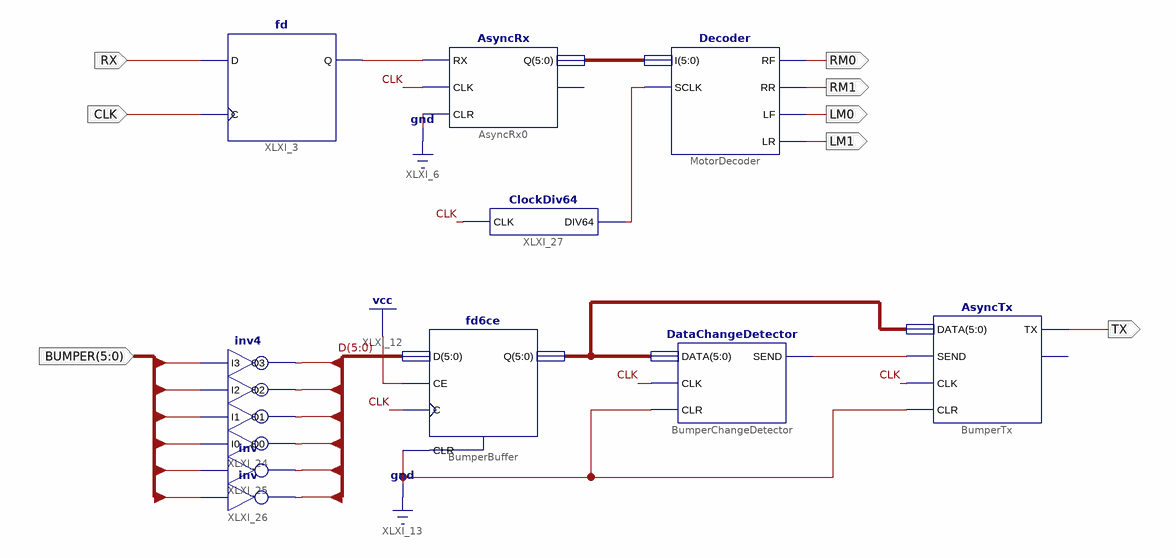
[diagram p0: schematic sheet 1]
// Xilinx ISE schematic RobotMain.sch (xc9500xl) as structural Verilog: 11 symbols, 8 ports
module RobotMain (
  input  RX,
  input  CLK,
  input  [5:0] BUMPER,
  output RM0,
  output RM1,
  output LM0,
  output LM1,
  output TX
);

  wire XLXN_1, XLXN_11, XLXN_27;
  wire [5:0] D, XLXN_7, XLXN_10;

  AsyncRx AsyncRx0 (.CLK(CLK), .CLR(1'b0), .Q(XLXN_7), .RX(XLXN_1));  // open: UPDATE
  fd XLXI_3 (.C(CLK), .D(RX), .Q(XLXN_1));
  Decoder MotorDecoder (.I(XLXN_7), .LF(LM0), .LR(LM1), .RF(RM0), .RR(RM1), .SCLK(XLXN_27));
  ClockDiv64 ClockDivider (.CLK(CLK));  // open: DIV64
  DataChangeDetector BumperChangeDetector (.CLK(CLK), .CLR(1'b0), .DATA(XLXN_10), .SEND(XLXN_11));
  fd6ce BumperBuffer (.C(CLK), .CE(1'b1), .CLR(1'b0), .D(D), .Q(XLXN_10));
  AsyncTx BumperTx (.CLK(CLK), .CLR(1'b0), .DATA(XLXN_10), .SEND(XLXN_11), .TX(TX));  // open: ACTIVE
  not XLXI_26 (D[5], BUMPER[5]);
  not XLXI_25 (D[4], BUMPER[4]);
  inv4 XLXI_24 (
    .I0(BUMPER[3]), .I1(BUMPER[2]), .I2(BUMPER[1]), .I3(BUMPER[0]), .O0(D[3]), .O1(D[2]), .O2(D[1]), .O3(D[0]));
  ClockDiv64 XLXI_27 (.CLK(CLK), .DIV64(XLXN_27));
endmodule
